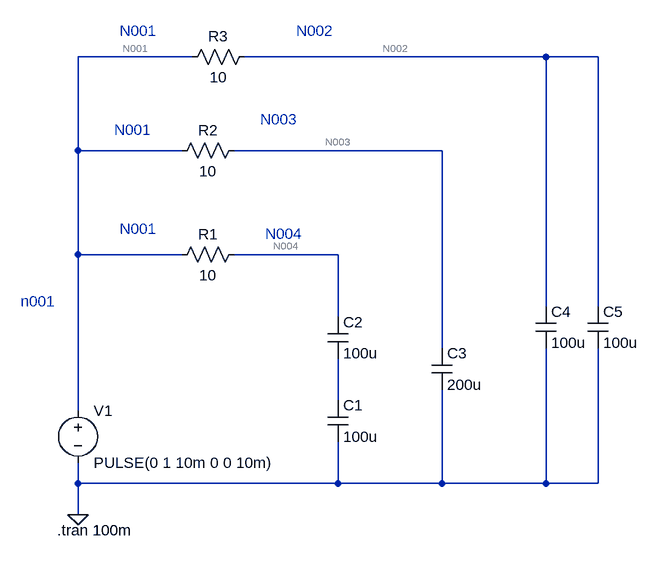
[diagram p0: schematic Yoneda-p52__v2__2-Cs-series.asc]
Yoneda-p52__v2__2-Cs-series.asc, the LTspice schematic file:
Version 4
SHEET 1 1288 680
WIRE 592 -928 416 -928
WIRE 1136 -928 672 -928
WIRE 1216 -928 1136 -928
WIRE 416 -784 416 -928
WIRE 576 -784 416 -784
WIRE 976 -784 656 -784
WIRE 416 -624 416 -784
WIRE 576 -624 416 -624
WIRE 816 -624 656 -624
WIRE 1136 -544 1136 -928
WIRE 1216 -544 1216 -928
WIRE 816 -528 816 -624
WIRE 976 -480 976 -784
WIRE 816 -400 816 -464
WIRE 416 -384 416 -624
WIRE 416 -272 416 -304
WIRE 816 -272 816 -336
WIRE 816 -272 416 -272
WIRE 976 -272 976 -416
WIRE 976 -272 816 -272
WIRE 1136 -272 1136 -480
WIRE 1136 -272 976 -272
WIRE 1216 -272 1216 -480
WIRE 1216 -272 1136 -272
WIRE 416 -224 416 -272
FLAG 416 -224 0
SYMBOL voltage 416 -400 R0
WINDOW 123 0 0 Left 2
WINDOW 39 0 0 Left 2
SYMATTR InstName V1
SYMATTR Value PULSE(0 1 10m 0 0 10m)
SYMBOL res 560 -608 R270
WINDOW 0 32 56 VTop 2
WINDOW 3 0 56 VBottom 2
SYMATTR InstName R1
SYMATTR Value 10
SYMBOL cap 800 -400 R0
SYMATTR InstName C1
SYMATTR Value 100u
SYMBOL cap 800 -528 R0
SYMATTR InstName C2
SYMATTR Value 100u
SYMBOL res 560 -768 R270
WINDOW 0 32 56 VTop 2
WINDOW 3 0 56 VBottom 2
SYMATTR InstName R2
SYMATTR Value 10
SYMBOL cap 960 -480 R0
SYMATTR InstName C3
SYMATTR Value 200u
SYMBOL res 576 -912 R270
WINDOW 0 32 56 VTop 2
WINDOW 3 0 56 VBottom 2
SYMATTR InstName R3
SYMATTR Value 10
SYMBOL cap 1120 -544 R0
SYMATTR InstName C4
SYMATTR Value 100u
SYMBOL cap 1200 -544 R0
SYMATTR InstName C5
SYMATTR Value 100u
TEXT 384 -200 Left 2 !.tran 100m
TEXT 480 -664 Left 2 ;N001
TEXT 472 -816 Left 2 ;N001
TEXT 480 -968 Left 2 ;N001
TEXT 704 -656 Left 2 ;N004
TEXT 752 -968 Left 2 ;N002
TEXT 696 -832 Left 2 ;N003
TEXT 328 -552 Left 2 ;n001

The netlist it stands for:
* Yoneda-p52__v2__2-Cs-series.asc
V1 N001 0 PULSE(0 1 10m 0 0 10m)
R1 N001 N004 10
C1 N005 0 100u
C2 N004 N005 100u
R2 N001 N003 10
C3 N003 0 200u
R3 N001 N002 10
C4 N002 0 100u
C5 N002 0 100u
.tran 100m
* N001
* N001
* N001
* N004
* N002
* N003
* n001
.backanno
.end

* Results of the author's LTspice run, read from the files saved beside the schematic
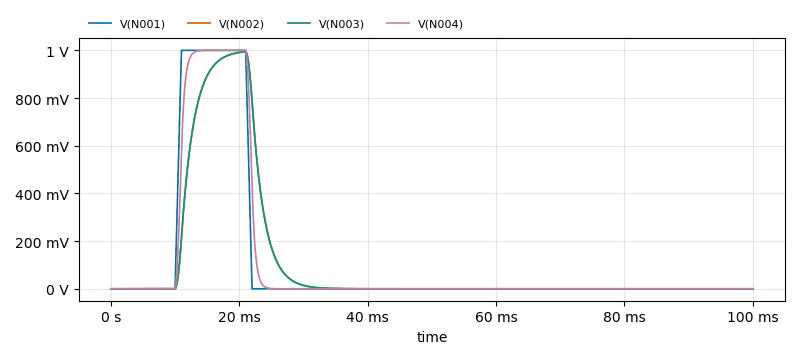
[diagram p1: Transient Analysis of Yoneda-p52__v2__2-Cs-series.asc, plotted from the saved traces]
* Transient Analysis, 1 run:
*   V(N001): min 0 V, max 1 V, average 110 mV, rms 326.7 mV, last 0 V
*   V(N002): min 0 V, max 994.7 mV, average 110 mV, rms 299.5 mV, last 0 V
*   V(N003): min 0 V, max 994.7 mV, average 110 mV, rms 299.5 mV, last 0 V
*   V(N004): min 0 V, max 1 V, average 110 mV, rms 322.2 mV, last 0 V